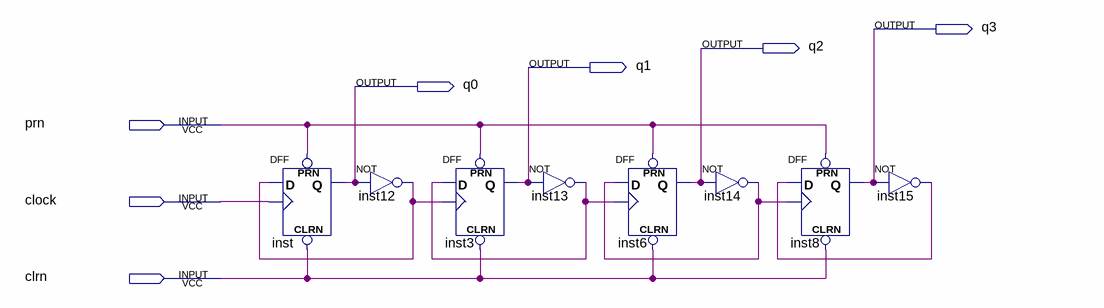
[diagram p0: schematic sheet]
// Quartus schematic mytest3.bdf as structural Verilog: 8 symbols, 7 pins
module mytest3 (
  input  prn,
  input  clock,
  input  clrn,
  output q3,
  output q2,
  output q1,
  output q0
);

  wire inst12_out, inst13_out, inst14_out, inst15_out;

  DFF inst (.CLRN(clrn), .CLK(clock), .D(inst12_out), .PRN(prn), .Q(q0));
  not inst12 (inst12_out, q0);
  DFF inst3 (.CLRN(clrn), .CLK(inst12_out), .D(inst13_out), .PRN(prn), .Q(q1));
  not inst13 (inst13_out, q1);
  DFF inst6 (.CLRN(clrn), .CLK(inst13_out), .D(inst14_out), .PRN(prn), .Q(q2));
  not inst14 (inst14_out, q2);
  DFF inst8 (.CLRN(clrn), .CLK(inst14_out), .D(inst15_out), .PRN(prn), .Q(q3));
  not inst15 (inst15_out, q3);
endmodule
